# Altium project sample_Project.PrjPcb
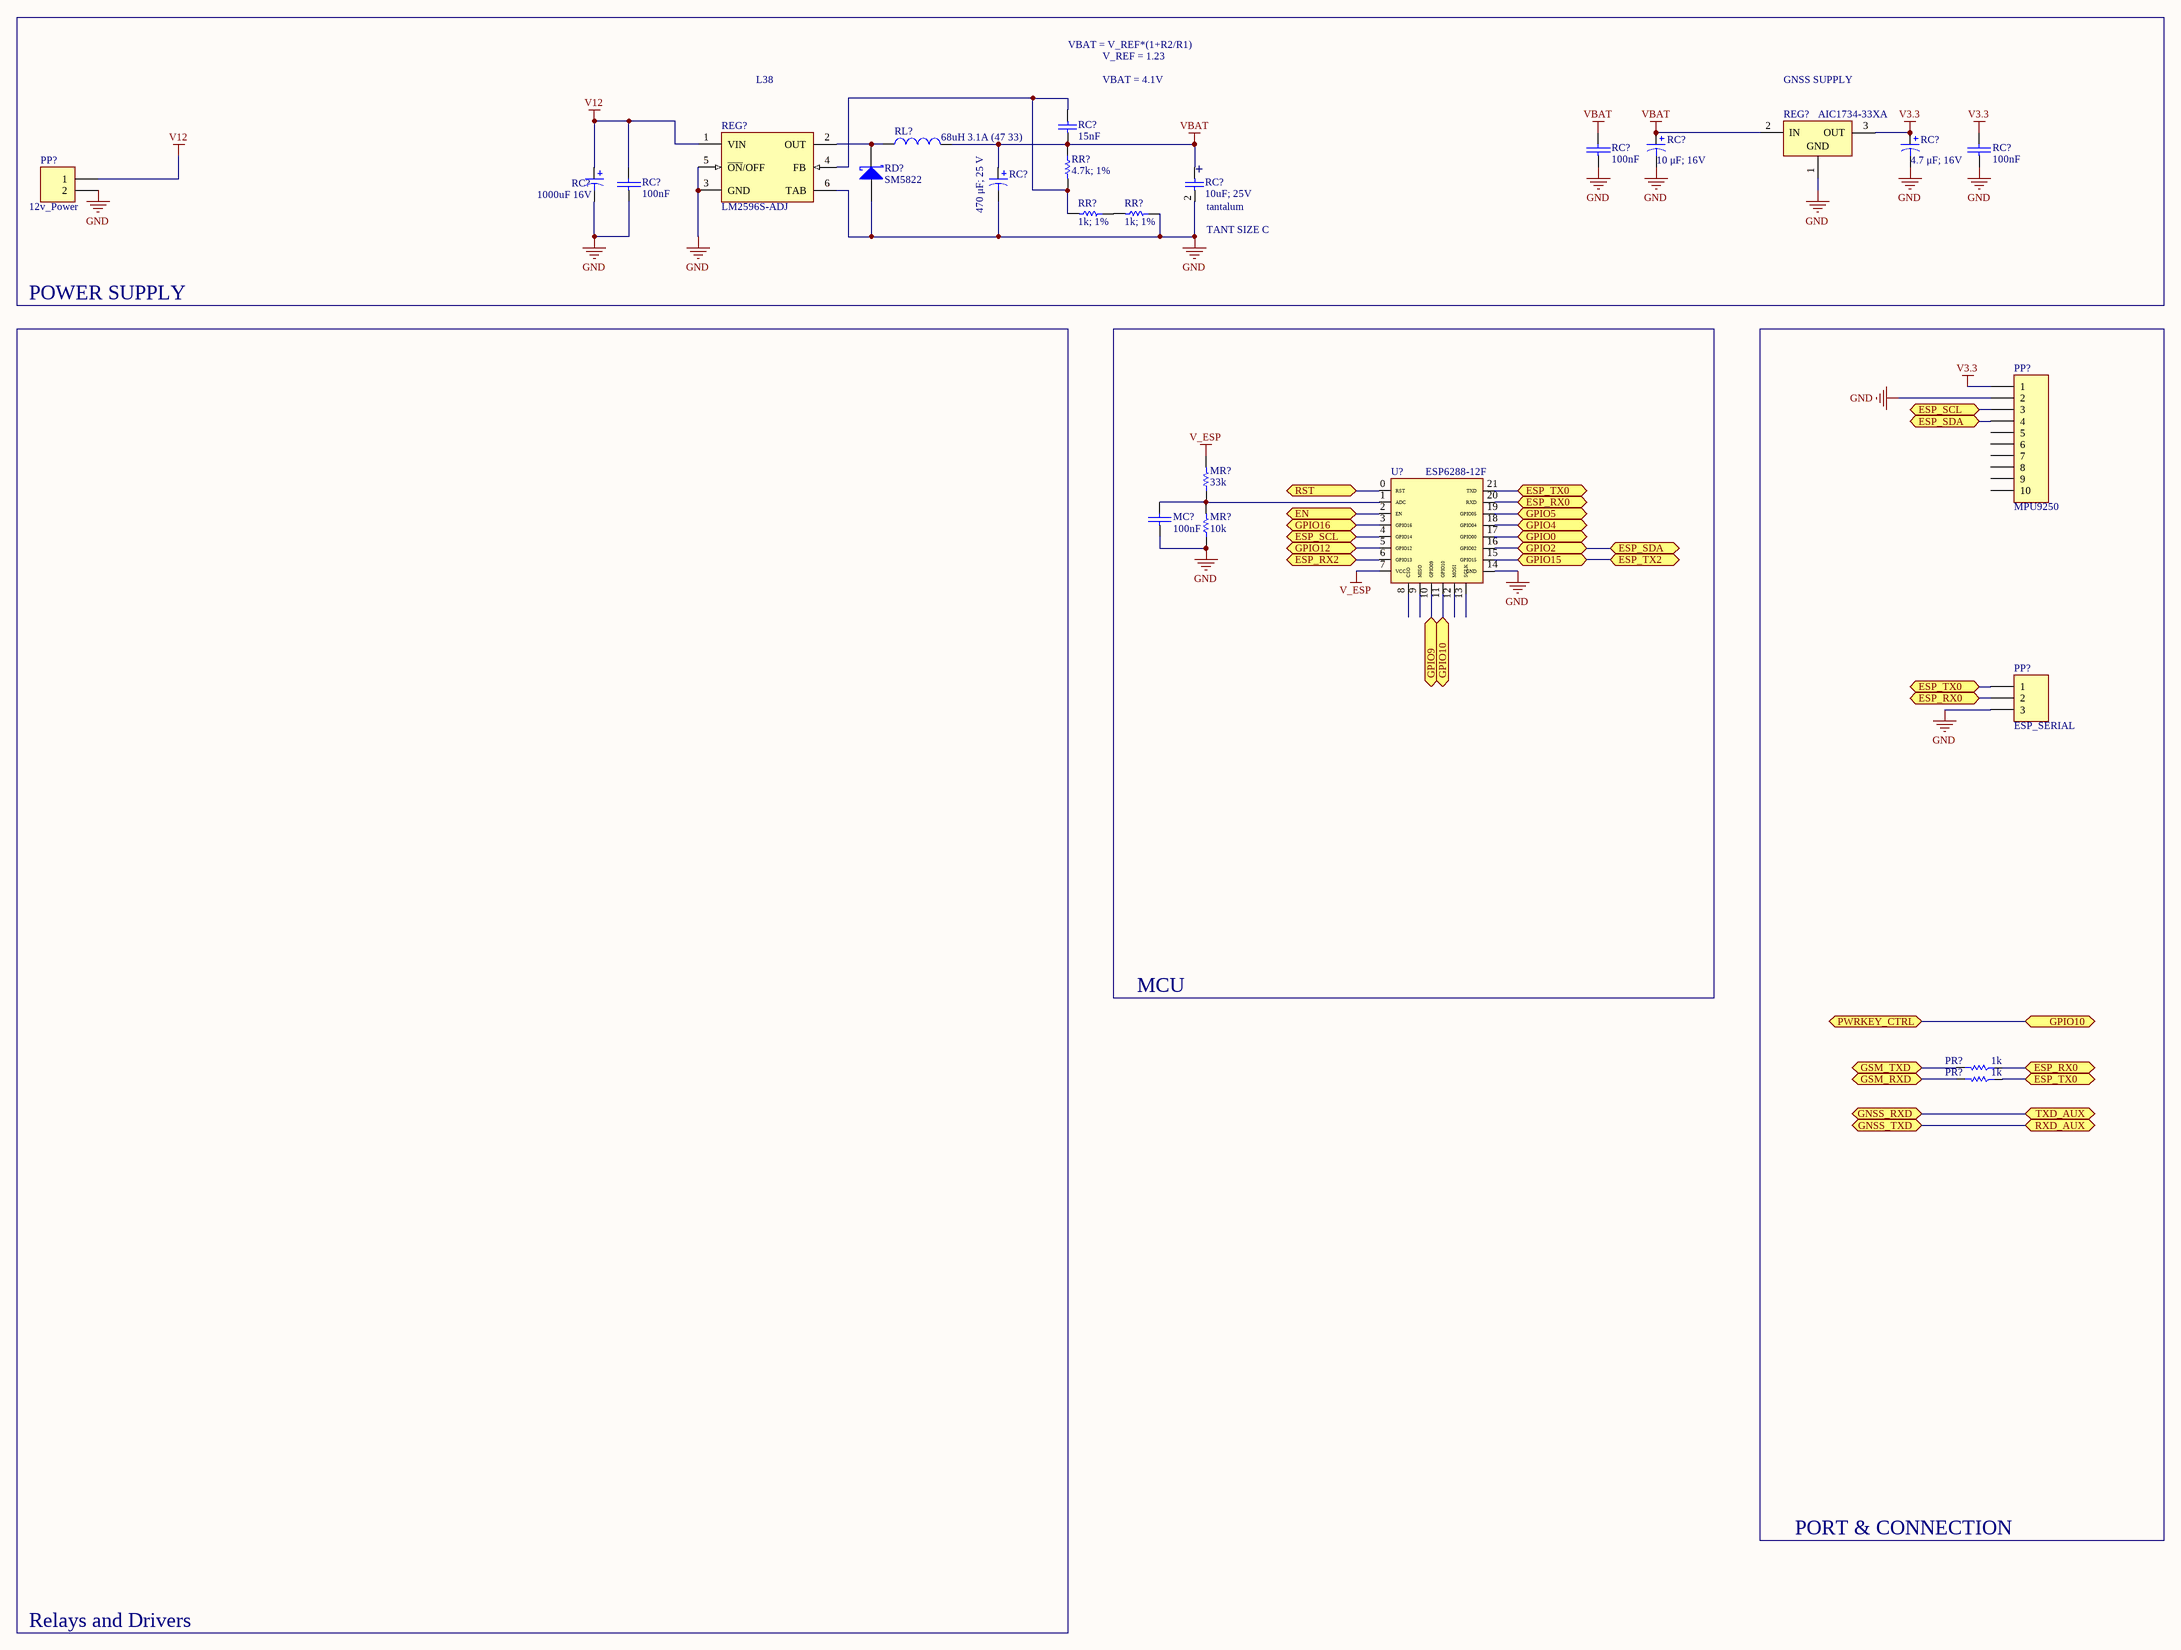
[diagram p0: sample_SCH.SchDoc]
1 sheet, 25 parts. Net scope: flat (ports and power ports of the same name join across sheets).
Board file: sample_PCB.PcbDoc

## Sheet sample_SCH.SchDoc
size C

### Parts
(Parts that share a designator on the sheet are numbered #1, #2 ... from top to bottom, then left to right.)
MC?  100nF  [C1206]
MR?#1  33k  [C1206]
MR?#2  10k  [C1206]
PP?#1  12v_Power  [phoenix terminal R 2]
PP?#2  MPU9250  [HDR1X10]
PP?#3  ESP_SERIAL  [HDR1X3]
PR?#1  1k  [C1206]
PR?#2  1k  [C1206]
RC?#1  15nF  [C1206]
RC?#2  100nF  [C1206]
RC?#3  10 μF; 16V  [WCAP-PSLP 5x5.8x1.4]
RC?#4  4.7 μF; 16V  [WCAP-PSLP 5x5.8x1.4]
RC?#5  100nF  [C1206]
RC?#6  1000uF 16V  [CAPR5-4X5]
RC?#7  100nF  [C1206]
RC?#8  470 μF; 25 V  [WCAP-PSLC 10x12.4x4.5]
RC?#9  10uF; 25V  TYPE: tantalum  [CAPCP6032X280N]
RD?  SM5822  [SMB]
REG?#1  AIC1734-33XA  [SOT89N]
REG?#2  LM2596S-ADJ  [TS5B_N]
RL?  68uH 3.1A (47 33)  [CAPR5-4X5]
RR?#1  4.7k; 1%  [C1206]
RR?#2  1k; 1%  [C1206]
RR?#3  1k; 1%  [C1206]
U?  ESP6288-12F  [ESP8266-12F]

### Blocks framed on the sheet
POWER SUPPLY: PP?#1 RC?#1-RC?#9 RD? REG?#1 REG?#2 RL? RR?#1-RR?#3
MCU: MC? MR?#1 MR?#2 U?
PORT & CONNECTION: PP?#2 PP?#3 PR?#1 PR?#2

### Ports
EN (bidir), ESP_RX0 (bidir), ESP_RX2 (bidir), ESP_SCL (bidir), ESP_SDA (bidir), ESP_TX0 (bidir), ESP_TX2 (bidir), GNSS_RXD (bidir), GNSS_TXD (bidir), GPIO0 (bidir), GPIO2 (bidir), GPIO4 (bidir), GPIO5 (bidir), GPIO9 (bidir), GPIO10 (bidir), GPIO12 (bidir), GPIO15 (bidir), GPIO16 (bidir), GSM_RXD (bidir), GSM_TXD (bidir), PWRKEY_CTRL (bidir), RST (bidir), RXD_AUX (bidir), TXD_AUX (bidir)

### Nets
GND: MC?.2(-) MR?#2.1 PP?#1.2 PP?#2.2 PP?#3.3 RC?#2.2(-) RC?#3.2 RC?#4.2 RC?#5.2(-) RC?#6.2 RC?#7.2(-) RC?#8.2 RC?#9.2 RD?.1(A) REG?#1.1(GND) REG?#2.3(GND) REG?#2.5(~{ON}/OFF) REG?#2.6(TAB) RR?#3.1 U?.14(GND)
V3.3: PP?#2.1 RC?#4.1 RC?#5.1(+) REG?#1.3(OUT)
V12: PP?#1.1 RC?#6.1 RC?#7.1(+) REG?#2.1(VIN)
V_ESP: MR?#1.2 U?.7(VCC)
VBAT: RC?#1.1 RC?#2.1(+) RC?#3.1 RC?#8.1 RC?#9.1 REG?#1.2(IN) RL?.2 RR?#1.1
NetMC?_1: MC?.1(+) MR?#1.1 MR?#2.2 U?.1(ADC)
NetPP?#2_3: PP?#2.3 U?.4(GPIO14) ; port ESP_SCL
NetPP?#2_4: PP?#2.4 U?.16(GPIO02) ; port ESP_SDA, port GPIO2
NetPP?#3_1: PP?#3.1 PR?#2.1 U?.21(TXD) ; port ESP_TX0
NetPP?#3_2: PP?#3.2 PR?#1.1 U?.20(RXD) ; port ESP_RX0
NetPR?#1_2: PR?#1.2 ; port GSM_TXD
NetPR?#2_2: PR?#2.2 ; port GSM_RXD
NetRC?#1_2: RC?#1.2 REG?#2.4(FB) RR?#1.2 RR?#2.2
NetRD?_2: RD?.2(K) REG?#2.2(OUT) RL?.1
NetRR?#2_1: RR?#2.1 RR?#3.2
NetU?_0: U?.0(RST) ; port RST
NetU?_2: U?.2(EN) ; port EN
NetU?_3: U?.3(GPIO16) ; port GPIO16
NetU?_5: U?.5(GPIO12) ; port GPIO12
NetU?_6: U?.6(GPIO13) ; port ESP_RX2
NetU?_10: U?.10(GPIO09) ; port GPIO9
NetU?_11: U?.11(GPIO10) ; port PWRKEY_CTRL, port GPIO10
NetU?_15: U?.15(GPIO15) ; port GPIO15, port ESP_TX2
NetU?_17: U?.17(GPIO00) ; port GPIO0
NetU?_18: U?.18(GPIO04) ; port GPIO4
NetU?_19: U?.19(GPIO05) ; port GPIO5
(unnamed): port TXD_AUX, port GNSS_RXD
(unnamed): port RXD_AUX, port GNSS_TXD

Not connected (* = marked no-connect by the designer): PP?#2 5 6 7 8 9 10; U? 8(CSO) 9(MISO) 12(MOSI) 13(SCLK)

### Notes on the sheet
- L38
- VBAT = V_REF*(1+R2/R1)
- VBAT = 4.1V
- V_REF = 1.23
- GNSS SUPPLY
- (near RC?#9) +
- (near RC?#9) TANT SIZE C
- Relays and Drivers

### Library data of the parts
MC? RC?#2 RC?#5 RC?#7 = Cap-Bipolar: Bipolar Capacitor; Voltage: 100V; Designer: Saeid Jorablo; Organazation: ControTec; Adding Date: 1387/12/20; Value: 100nF
MR?#1 MR?#2 RR?#1-RR?#3 = Res1: Resistor; Published: 8-Jun-2000; LatestRevisionDate: 17-Jul-2002; LatestRevisionNote: Re-released for DXP Platform.; PackageReference: AXIAL-0.3; Publisher: Altium Limited; PackageDescription: Axial Device, Thru-Hole; 2 Leads; 0.3 in Pin Spacing
  MR?#1: Value: 33k
  MR?#2: Value: 10k
  RR?#1: Value: 4.7k; 1%
  RR?#2 RR?#3: Value: 1k; 1%
PP?#1 = Header 2: Header, 2-Pin; LatestRevisionDate: 17-Jul-2002; LatestRevisionNote: Re-released for DXP Platform.; Publisher: Altium Limited
PP?#2 = Header 10: Header, 10-Pin; LatestRevisionDate: 17-Jul-2002; LatestRevisionNote: Re-released for DXP Platform.; Publisher: Altium Limited
PP?#3 = Header 3: Header, 3-Pin; LatestRevisionDate: 17-Jul-2002; LatestRevisionNote: Re-released for DXP Platform.; Publisher: Altium Limited
PR?#1 PR?#2 = Resistor: Value: 1k
RC?#1 RC?#9 = Cap: Capacitor; STATE: NOT-AVAILABLE; Published: 8-Jun-2000; LatestRevisionDate: 17-Jul-2002; LatestRevisionNote: Re-released for DXP Platform.; PackageReference: RAD-0.3; Publisher: Altium Limited; PackageDescription: Radial Cap, Thru-Hole; 2 Leads; 0.3 in Pin Spacing
  RC?#1: TYPE: tantalum
RC?#3 = WCAP-PSLP 5x5.8x1.4 875105359001: WCAP-PSLP Aluminum Polymer Capacitors , 10 μF; + / - 20%; 16 V , 5 x 5,8; Manufacturer: Wurth Elektronik; E-mail: libraries@we-online.com; Capacitance: 10 μF; Characteristics: Aluminum Polymer Capacitors;Recommended soldering: Reflow;Operating temperature: –55 °C to +105 °C;Low profile SMD product series;Low ESR at high frequency range;High permissible ripple current;Load life: 2000 h @ +105 °C; ComponentLink1Description: Manufacturer; ComponentLink1URL: http://www.we-online.com; ComponentLink2Description: Datasheet; ComponentLink2URL: http://katalog.we-online.de/pbs/datasheet/875105359001.pdf; Created by: Karrer Zheng; Created Date: 5/13/2015; Application: Low voltage port filtering, appplid to high-end switching power supply, PC(desktop,laptop ),industrial computer, VGA card, server power, charger, TV, digital set-top box,DC-DC power module, game machine etc which consume large current with high speed circuit.; partNo: 875105359001
RC?#4 = WCAP-PSLP 5x5.8x1.4 875105359003: WCAP-PSLP Aluminum Polymer Capacitors , 22 μF; + / - 20%; 16 V , 5 x 5,8; Manufacturer: Wurth Elektronik; E-mail: libraries@we-online.com; Capacitance: 22 μF; Characteristics: Aluminum Polymer Capacitors;Recommended soldering: Reflow;Operating temperature: –55 °C to +105 °C;Low profile SMD product series;Low ESR at high frequency range;High permissible ripple current;Load life: 2000 h @ +105 °C; ComponentLink1Description: Manufacturer; ComponentLink1URL: http://www.we-online.com; ComponentLink2Description: Datasheet; ComponentLink2URL: http://katalog.we-online.de/pbs/datasheet/875105359003.pdf; Created by: Karrer Zheng; Created Date: 5/13/2015; Application: Low voltage port filtering, appplid to high-end switching power supply, PC(desktop,laptop ),industrial computer, VGA card, server power, charger, TV, digital set-top box,DC-DC power module, game machine etc which consume large current with high speed circuit.; partNo: 875105359003
RC?#6 = Cap Pol1: Polarized Capacitor (Radial); Value: 100pF; Published: 8-Jun-2000; LatestRevisionDate: 17-Jul-2002; LatestRevisionNote: Re-released for DXP Platform.; PackageReference: RB7.6-15; Publisher: Altium Limited; PackageDescription: Polarized Capacitor (Radial); 2 Leads
RC?#8 = WCAP-PSLC 10x12.4x4.5 875075361006: WCAP-PSLC Aluminum Polymer Capacitors , 680 μF; + / - 20%; 16 V , 10 x 12,4; Manufacturer: Wurth Elektronik; E-mail: libraries@we-online.com; Capacitance: 680 μF; Characteristics: Aluminum Polymer Capacitors; Recommended soldering: Reflow; Operating temperature: –55 °C to +105 °C; Large capacitance SMD product series; Very low ESR at high frequency range; High permissible ripple current; Long life and high reliability; Load life: 2000 h @ +105 °C; ComponentLink1Description: Manufacturer; ComponentLink1URL: http://www.we-online.com; ComponentLink2Description: Datasheet; ComponentLink2URL: http://katalog.we-online.de/pbs/datasheet/875075361006.pdf; Created by: Karrer Zheng; Created Date: 6/8/2015; Application: Low voltage port filtering, appplid to high-end switching power supply, PC(desktop,laptop ),industrial computer, VGA card, server power, charger, TV, digital set-top box,DC-DC power module, game machine etc which consume large current with high speed circuit.; partNo: 875075361006
RD? = D Schottky: Schottky Diode; Published: 8-Jun-2000; LatestRevisionDate: 17-Jul-2002; LatestRevisionNote: Re-released for DXP Platform.; PackageReference: SMB; Publisher: Altium Limited; PackageDescription: DO-214-AA/SMB; 2 C-Bend Leads; Body 5.3 x 3.6 mm, inc. leads (LxW); Code_JEDEC: DO-214-AA
REG?#1 = HT7530-1: 3.0V 100mA Low Power,  Low Dropout Voltage (LDO) Regulator; Published: 30-Mar-2007; DatasheetVersion: rev1.50, Jan-2006; PackageVersion: Jan-2006; PackageReference: SOT-89; Publisher: Altium Limited; PackageDescription: 3-Pin SOT-89 Package 1.5 mm Pitch, 4.1 mm Lead Span; Code_IPC: SOT89; ComponentLink1Description: Manufacturer Link; ComponentLink1URL: http://www.holtek.com/; ComponentLink2Description: Datasheet; ComponentLink2URL: http://www.holtek.com/pdf/consumer/75xx_1v150.pdf
REG?#2 = LM2596S-ADJ: SIMPLE SWITCHER® Power Converter 150 KHz 3A Step-Down Voltage Regulator, 5-pin TO-263; Manufacturer: National Semiconductor; PackageTopMarking: NSUZXYTTE#*LM2596S*-ADJ P+; PowerWise: N; Published: 4-Dec-2008; DatasheetVersion: May-2002; PackageVersion: revD, Apr-2005; PackageReference: TS5B; Publisher: Altium Limited; PackageDescription: TO-263, Molded, .400 x .390 x .180in, 5 Lead, .067in Pitch, Surface Mount; Supplier 1: Farnell; Supplier Part Number 1: 1523864; Supplier 2: Farnell; Supplier Part Number 2: 9494367; PartNumber: LM2596S-ADJ; RoHS: N; PinCount: 5; CompType: Switcher; Code_JEDEC: MO-169-AB; ComponentLink1Description: LM2596 Datasheet; ComponentLink1URL: http://www.national.com/ds/LM/LM2596.pdf; ComponentLink2Description: LM2596 Web Page; ComponentLink2URL: http://www.national.com/pf/LM/LM2596.html; ComponentLink3Description: TS5B Package Page; ComponentLink3URL: http://www.national.com/packaging/folders/ts5b.html
RL? = Inductor: Code_IEC: 1005; Value: 10mH; Published: 8-Jun-2000; LatestRevisionDate: 29-May-2009; LatestRevisionNote: IPC-7351 Footprint Added.; PackageReference: 0402-A; Publisher: Altium Limited; PackageDescription: Chip Inductor; Code_JEITA: 0402
U? = ESP8266-12F: Value: ESP6288-12F